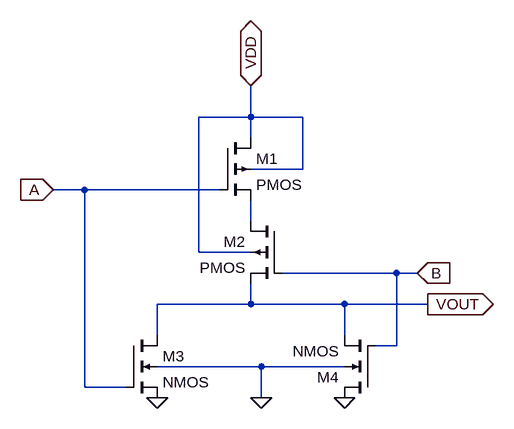
[diagram p0: schematic nor.asc]
nor.asc, the LTspice schematic file:
Version 4
SHEET 1 888 680
WIRE 400 -128 400 -176
WIRE 400 -128 320 -128
WIRE 480 -128 400 -128
WIRE 400 -96 400 -128
WIRE 480 -48 480 -128
WIRE 480 -48 400 -48
WIRE 144 -16 96 -16
WIRE 352 -16 144 -16
WIRE 400 32 400 0
WIRE 320 80 320 -128
WIRE 400 80 320 80
WIRE 624 112 448 112
WIRE 656 112 624 112
WIRE 400 160 400 128
WIRE 400 160 256 160
WIRE 544 160 400 160
WIRE 672 160 544 160
WIRE 256 208 256 160
WIRE 544 208 544 160
WIRE 624 224 624 112
WIRE 624 224 592 224
WIRE 416 256 256 256
WIRE 544 256 416 256
WIRE 144 288 144 -16
WIRE 208 288 144 288
WIRE 416 304 416 256
FLAG 96 -16 A
IOPIN 96 -16 In
FLAG 656 112 B
IOPIN 656 112 In
FLAG 400 -176 VDD
IOPIN 400 -176 BiDir
FLAG 672 160 VOUT
IOPIN 672 160 Out
FLAG 256 304 0
FLAG 544 304 0
FLAG 416 304 0
SYMBOL pmos4 352 -96 R0
SYMATTR InstName M1
SYMATTR Value2 l=5u w=80u
SYMBOL pmos4 448 32 M0
SYMATTR InstName M2
SYMATTR Value2 l=5u w=80u
SYMBOL nmos4 208 208 R0
SYMATTR InstName M3
SYMATTR Value2 l=5u w=10u
SYMBOL nmos4 592 304 R180
SYMATTR InstName M4
SYMATTR Value2 l=5u w=10u

The netlist it stands for:
* nor.asc
M1 VDD A N001 VDD PMOS l=5u w=80u
M2 N001 B VOUT VDD PMOS l=5u w=80u
M3 VOUT A 0 0 NMOS l=5u w=10u
M4 0 B VOUT 0 NMOS l=5u w=10u
.model NMOS NMOS
.model PMOS PMOS
.lib standard.mos
.backanno
.end